# EAGLE design Robot Arm Controller (EAGLE 7.7.0)

## Sheet 1 of 2
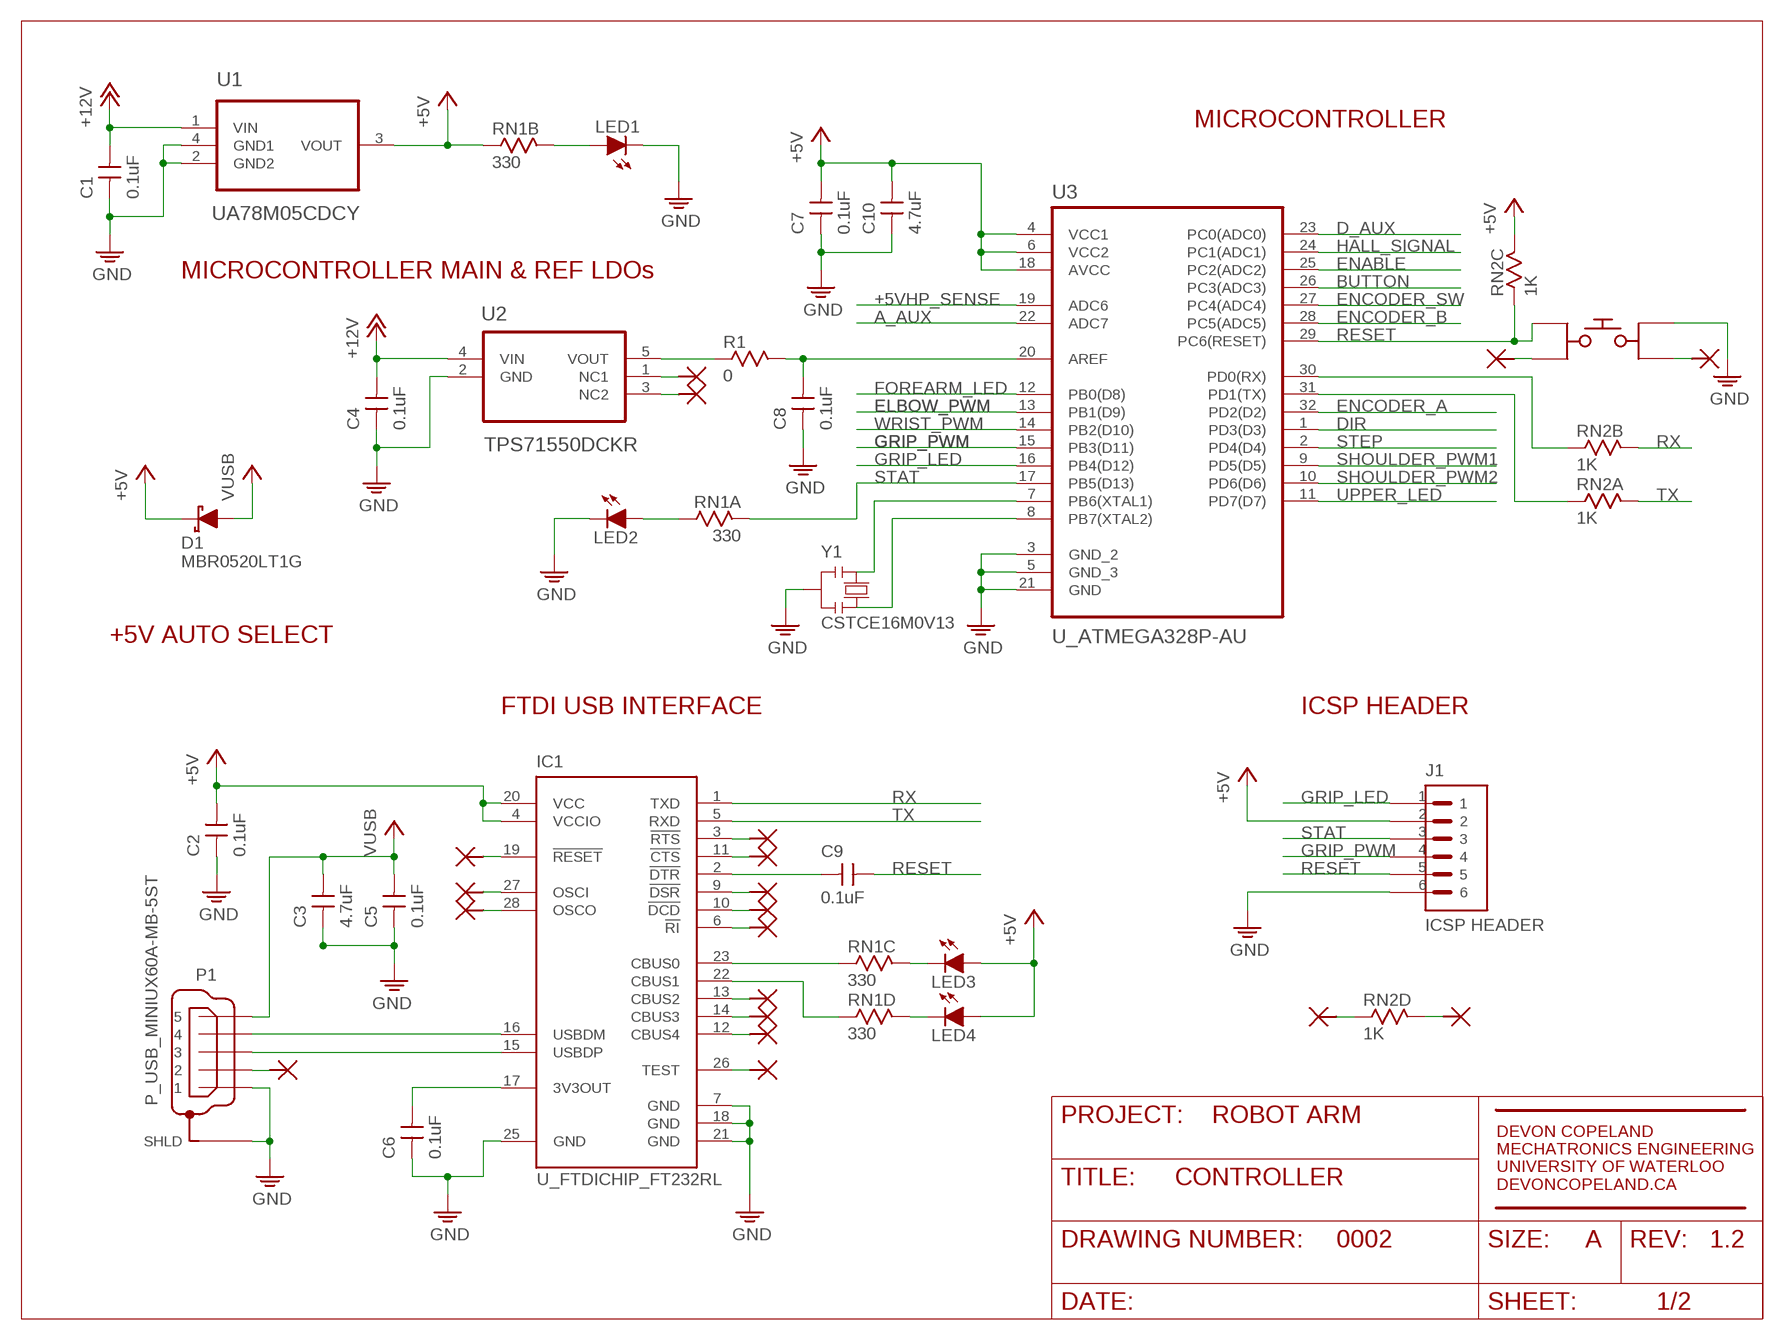
[diagram p0: schematic, sheet 1]

### Parts
C1  0.1uF  C_CAPACITORC0805  [C0805]
C2  0.1uF  C_CAPACITORC0805  [C0805]
C3  4.7uF  C_CAPACITORC0805  [C0805]
C4  0.1uF  C_CAPACITORC0805  [C0805]
C5  0.1uF  C_CAPACITORC0805  [C0805]
C6  0.1uF  C_CAPACITORC0805  [C0805]
C7  0.1uF  C_CAPACITORC0805  [C0805]
C8  0.1uF  C_CAPACITORC0805  [C0805]
C9  0.1uF  C_CAPACITORC0805  [C0805]
C10  4.7uF  C_CAPACITORC0805  [C0805]
D1  MBR0520LT1G  D_SCHOTTKY_MBR0520LT1G  [MBR0520LT1G]
IC1  U_FTDICHIP_FT232RL  [SSOP28]
J1  ICSP HEADER  J_HEADER_RECTANGULAR_2X6  [RECTANGULAR_HEADER_2X3]
LED1  D_LEDSML0805  [SML0805]
LED2  D_LEDSML0805  [SML0805]
LED3  D_LEDSML0805  [SML0805]
LED4  D_LEDSML0805  [SML0805]
P1  P_USB_MINIUX60A-MB-5ST  [UX60A-MB-5ST]
R1  0  R_RESISTOR0805  [R0805]
RN1  330  R_RESISTOR_NETWORK_EXB-V8V103JV  [EXBV8V]
RN2  1K  R_RESISTOR_NETWORK_EXB-V8V103JV  [EXBV8V]
S1  S_BUTTON_TACTILE_PTS645  [PTS645-SMD]
U1  UA78M05CDCY  U_5VLDO_UA78M05CDCY  [SOT230P700X180-4N]
U2  TPS71550DCKR  U_5VLDO_TPS71550DCKR  [SOT65P210X110-5N]
U3  U_ATMEGA328P-AU  [QFP80P900X900X120-32N]
Y1  CSTCE16M0V13  G_RESONATORMU  [CSTCE_V13L]

### Nets
+5V: C2.1 C7.1 C10.1 D1.C IC1.4(VCCIO) IC1.20(VCC) J1.2 LED3.A LED4.A RN1.2A RN2.3B U1.3(VOUT) U3.4(VCC1) U3.6(VCC2) U3.18(AVCC) ; also sheet 2
+5VHP_SENSE: U3.19(ADC6) ; also sheet 2
+12V: C1.1 C4.1 U1.1(VIN) U2.4(VIN) ; also sheet 2
A_AUX: U3.22(ADC7) ; also sheet 2
BUTTON: U3.26(PC3(ADC3)) ; also sheet 2
D_AUX: U3.23(PC0(ADC0)) ; also sheet 2
DIR: U3.1(PD3(D3)) ; also sheet 2
ELBOW_PWM: U3.13(PB1(D9)) ; also sheet 2
ENABLE: U3.25(PC2(ADC2)) ; also sheet 2
ENCODER_A: U3.32(PD2(D2)) ; also sheet 2
ENCODER_B: U3.28(PC5(ADC5)) ; also sheet 2
ENCODER_SW: U3.27(PC4(ADC4)) ; also sheet 2
FOREARM_LED: U3.12(PB0(D8)) ; also sheet 2
GND: C1.2 C2.2 C3.2 C4.2 C5.2 C6.2 C7.2 C8.2 C10.2 IC1.7(GND) IC1.18(GND) IC1.21(GND) IC1.25(GND) J1.6 LED1.C LED2.C P1.5 P1.M1(SHLD) P1.M2(SHLD) P1.M3(SHLD) P1.M4(SHLD) S1.1 U1.2(GND2) U1.4(GND1) U2.2(GND) U3.3(GND_2) U3.5(GND_3) U3.21(GND) Y1.2 ; also sheet 2
GRIP_LED: J1.1 U3.16(PB4(D12)) ; also sheet 2
GRIP_PWM: J1.4 U3.15(PB3(D11)) ; also sheet 2
HALL_SIGNAL: U3.24(PC1(ADC1)) ; also sheet 2
N$1: IC1.19(!RESET)
N$2: IC1.27(OSCI)
N$3: LED2.A RN1.1B
N$4: U3.8(PB7(XTAL2)) Y1.3
N$5: IC1.28(OSCO)
N$6: C8.1 R1.2 U3.20(AREF)
N$7: U2.1(NC1)
N$8: IC1.16(USBDM) P1.2
N$9: RN2.1A U3.31(PD1(TX))
N$10: U2.3(NC2)
N$11: C6.1 IC1.17(3V3OUT)
N$12: IC1.26(TEST)
N$13: IC1.12(CBUS4)
N$14: IC1.14(CBUS3)
N$15: IC1.13(CBUS2)
N$16: U3.7(PB6(XTAL1)) Y1.1
N$17: LED1.A RN1.2B
N$18: R1.1 U2.5(VOUT)
N$20: RN2.2A U3.30(PD0(RX))
N$21: IC1.6(!RI)
N$22: IC1.10(!DCD)
N$23: IC1.9(!DSR)
N$24: IC1.11(!CTS)
N$25: IC1.3(!RTS)
N$26: IC1.15(USBDP) P1.3
N$27: C9.2 IC1.2(!DTR)
N$28: IC1.23(CBUS0) RN1.3A
N$29: IC1.22(CBUS1) RN1.4A
N$30: LED3.C RN1.3B
N$31: LED4.C RN1.4B
N$32: RN2.4A
N$33: RN2.4B
N$37: S1.2
N$38: S1.4
N$66: P1.4
RESET: C9.1 J1.5 RN2.3A S1.3 U3.29(PC6(RESET))
RX: IC1.1(TXD) RN2.2B
SHOULDER_PWM1: U3.9(PD5(D5)) ; also sheet 2
SHOULDER_PWM2: U3.10(PD6(D6)) ; also sheet 2
STAT: J1.3 RN1.1A U3.17(PB5(D13))
STEP: U3.2(PD4(D4)) ; also sheet 2
TX: IC1.5(RXD) RN2.1B
UPPER_LED: U3.11(PD7(D7)) ; also sheet 2
VUSB: C3.1 C5.1 D1.A P1.1
WRIST_PWM: U3.14(PB2(D10)) ; also sheet 2

### Notes on the sheet
- MICROCONTROLLER
- MICROCONTROLLER MAIN & REF LDOs
- +5V AUTO SELECT
- FTDI USB INTERFACE | ICSP HEADER
- ROBOT ARM
- CONTROLLER
- 0002 | A | 1.2

## Sheet 2 of 2
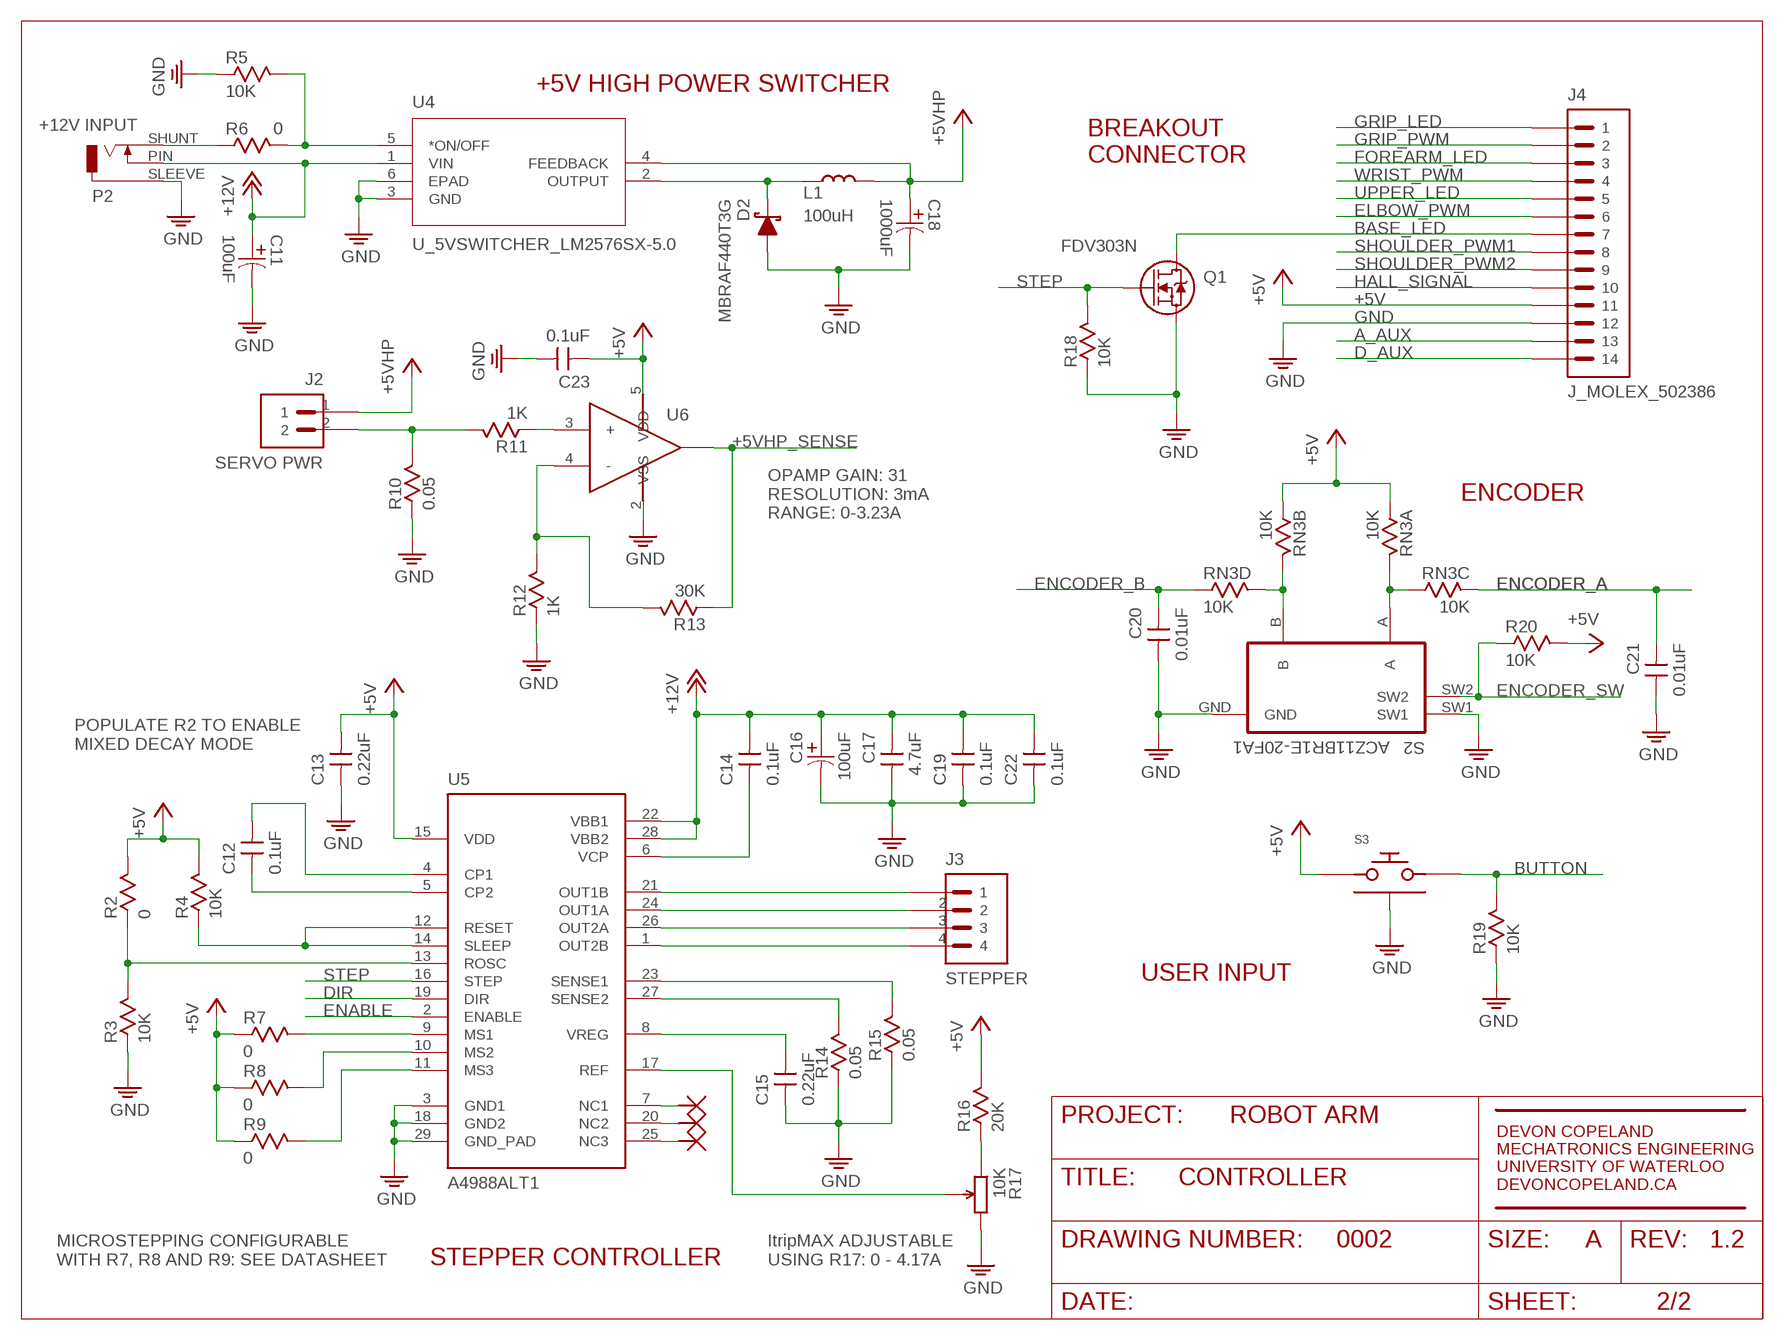
[diagram p1: schematic, sheet 2]

### Parts
C11  100uF  C_100UF_ALUMINUM_APXG160ARA101ME61G  [NPCAP_PXG_E61]
C12  0.1uF  C_CAPACITORC0805  [C0805]
C13  0.22uF  C_CAPACITORC0805  [C0805]
C14  0.1uF  C_CAPACITORC0805  [C0805]
C15  0.22uF  C_CAPACITORC0805  [C0805]
C16  100uF  C_100UF_ALUMINUM_APXG160ARA101ME61G  [NPCAP_PXG_E61]
C17  4.7uF  C_CAPACITORC0805  [C0805]
C18  1000uF  C_1000UF_ALUMINUM_APXG160ARA102MJA0G  [NPCAP_PXG_JA0]
C19  0.1uF  C_CAPACITORC0805  [C0805]
C20  0.01uF  C_CAPACITORC0805  [C0805]
C21  0.01uF  C_CAPACITORC0805  [C0805]
C22  0.1uF  C_CAPACITORC0805  [C0805]
C23  0.1uF  C_CAPACITORC0805  [C0805]
D2  MBRAF440T3G  D_SCHOTTKY_MBRAF440T3G  [MBRAF440T3G]
J2  SERVO PWR  J_SCREW_TERMINAL_2_POS  [SREW_TERMINAL_2_POS]
J3  STEPPER  J_SCREW_TERMINAL_4_POS  [SREW_TERMINAL_4_POS]
J4  J_MOLEX_502386  [MOLEX_502386]
L1  100uH  L_INDUCTOR_PA4344.104NLT  [PA4344.104NLT]
P2  +12V INPUT  P_BARREL_2.1MM  [RASM722PX]
Q1  FDV303N  Q_MOSFET_FDV303N  [SOT-23-3L]
R2  0  R_RESISTOR0805  [R0805]
R3  10K  R_RESISTOR0805  [R0805]
R4  10K  R_RESISTOR0805  [R0805]
R5  10K  R_RESISTOR0805  [R0805]
R6  0  R_RESISTOR0805  [R0805]
R7  0  R_RESISTOR0805  [R0805]
R8  0  R_RESISTOR0805  [R0805]
R9  0  R_RESISTOR0805  [R0805]
R10  0.05  R_RESISTOR1206  [R1206]
R11  1K  R_RESISTOR0805  [R0805]
R12  1K  R_RESISTOR0805  [R0805]
R13  30K  R_RESISTOR0805  [R0805]
R14  0.05  R_RESISTOR1206  [R1206]
R15  0.05  R_RESISTOR1206  [R1206]
R16  20K  R_RESISTOR0805  [R0805]
R17  10K  R_POT_EVM-2WSX80B14  [PANASONIC_P2W_POT]
R18  10K  R_RESISTOR0805  [R0805]
R19  10K  R_RESISTOR0805  [R0805]
R20  10K  R_RESISTOR0805  [R0805]
RN3  10K  R_RESISTOR_NETWORK_EXB-V8V103JV  [EXBV8V]
S2  ACZ11BR1E-20FA1  S_ENCODER_ACZ11BR1E-20FA1-20C  [ACZ11BR1E-20FA1-20C]
S3  S_BUTTON_TACTILE_KT11S1SA2M35LFG  [C&K_SA2M_SA1M]
U4  U_5VSWITCHER_LM2576SX-5.0  U_5VSWITCHER_LM2576SX-5.0/NOPB  [KTT5_6P22X6P86]
U5  A4988ALT1  U_STEPPER_DRIVER_A4988ALT1  [ALLEGRO_A4988]
U6  U_OPAMP_MCP6001T-E/OT  [SOT95P270X145-5N]

### Nets
+5V: C13.1 C23.2 J4.P11 R2.2 R4.2 R7.1 R8.1 R9.1 R16.2 R20.2 RN3.1A RN3.2A S3.1 U5.15(VDD) U6.5(VDD) ; also sheet 1
+5VHP: C18.+ J2.1 L1.2 U4.4(FEEDBACK)
+5VHP_SENSE: R13.1 U6.1(VOUT) ; also sheet 1
+12V: C11.+ C14.1 C16.+ C17.2 C19.1 C22.1 P2.PIN U4.1(VIN) U5.22(VBB1) U5.28(VBB2) ; also sheet 1
A_AUX: J4.P13 ; also sheet 1
BASE_LED: J4.P7 Q1.S(DRAIN)
BUTTON: R19.2 S3.2 ; also sheet 1
D_AUX: J4.P14 ; also sheet 1
DIR: U5.19(DIR) ; also sheet 1
ELBOW_PWM: J4.P6 ; also sheet 1
ENABLE: U5.2(ENABLE) ; also sheet 1
ENCODER_A: C21.2 RN3.3A ; also sheet 1
ENCODER_B: C20.2 RN3.4A ; also sheet 1
ENCODER_SW: R20.1 S2.SW2 ; also sheet 1
FOREARM_LED: J4.P3 ; also sheet 1
GND: C11.- C13.2 C15.2 C16.- C17.1 C18.- C19.2 C20.1 C21.1 C22.2 C23.1 D2.A J4.P12 P2.SLEEVE Q1.D(SOURCE) R3.1 R5.1 R10.1 R12.1 R14.1 R15.1 R17.3 R18.1 R19.1 S2.GND S2.SW1 S3.FRONT(HOUSING) S3.SIDE1(HOUSING) S3.SIDE2(HOUSING) U4.3(GND) U4.6(EPAD) U5.3(GND1) U5.18(GND2) U5.29(GND_PAD) U6.2(VSS) ; also sheet 1
GRIP_LED: J4.P1 ; also sheet 1
GRIP_PWM: J4.P2 ; also sheet 1
HALL_SIGNAL: J4.P10 ; also sheet 1
N$19: D2.C L1.1 U4.2(OUTPUT)
N$34: RN3.2B RN3.4B S2.B
N$35: R5.2 R6.2 U4.5(*ON/OFF)
N$36: RN3.1B RN3.3B S2.A
N$40: J3.1 U5.21(OUT1B)
N$43: R11.1 U6.3(+)
N$44: R12.2 R13.2 U6.4(-)
N$45: J2.2 R10.2 R11.2
N$46: J3.2 U5.24(OUT1A)
N$47: J3.3 U5.26(OUT2A)
N$48: J3.4 U5.1(OUT2B)
N$50: C15.1 U5.8(VREG)
N$51: R14.2 U5.27(SENSE2)
N$52: R16.1 R17.1
N$53: R15.2 U5.23(SENSE1)
N$54: R17.2 U5.17(REF)
N$55: U5.7(NC1)
N$56: U5.20(NC2)
N$57: U5.25(NC3)
N$58: C14.2 U5.6(VCP)
N$59: C12.2 U5.5(CP2)
N$60: C12.1 U5.4(CP1)
N$61: R8.2 U5.10(MS2)
N$62: R7.2 U5.9(MS1)
N$63: R9.2 U5.11(MS3)
N$64: R4.1 U5.12(RESET) U5.14(SLEEP)
N$65: R2.1 R3.2 U5.13(ROSC)
N$67: P2.SHUNT R6.1
SHOULDER_PWM1: J4.P8 ; also sheet 1
SHOULDER_PWM2: J4.P9 ; also sheet 1
STEP: Q1.G(GATE) R18.2 U5.16(STEP) ; also sheet 1
UPPER_LED: J4.P5 ; also sheet 1
WRIST_PWM: J4.P4 ; also sheet 1

### Notes on the sheet
- +5V HIGH POWER SWITCHER
- BREAKOUT
  CONNECTOR
- ENCODER
- OPAMP GAIN: 31
  RESOLUTION: 3mA 
  RANGE: 0-3.23A
- POPULATE R2 TO ENABLE
  MIXED DECAY MODE
- USER INPUT
- ROBOT ARM
- CONTROLLER
- 0002 | A | 1.2
- MICROSTEPPING CONFIGURABLE 
  WITH R7, R8 AND R9: SEE DATASHEET
- STEPPER CONTROLLER
- ItripMAX ADJUSTABLE
  USING R17: 0 - 4.17A

## Library data of the parts
C1-C10 C12-C15 C17 C19-C23 = devon:C_CAPACITOR: CAPACITOR, European symbol; SPICEMODEL: NONE; SPICEPREFIX: C
C11 C16 = devon:C_100UF_ALUMINUM_APXG160ARA101ME61G; DIGIKEY_PN: 565-4527-1-ND
C18 = devon:C_1000UF_ALUMINUM_APXG160ARA102MJA0G; DIGIKEY_PN: 565-4292-1-ND
D1 = devon:D_SCHOTTKY_MBR0520LT1G; DIGIKEY_PN: MBR0520LT1GOSCT-ND
D2 = devon:D_SCHOTTKY_MBRAF440T3G
IC1 = devon:U_FTDICHIP_FT232R: Source: http://www.ftdichip.com/Documents/DataSheets/DS_FT232R_v104.pdf; MPN: FT232RL; OC_FARNELL: 1146032; OC_NEWARK: 91K9918
J1 = devon:J_HEADER_RECTANGULAR_2X6
J2 = devon:J_SCREW_TERMINAL_2_POS
J3 = devon:J_SCREW_TERMINAL_4_POS
J4 = devon:J_MOLEX_502386
L1 = devon:L_INDUCTOR_PA4344.104NLT
LED1-LED4 = devon:D_LED: LED OSRAM: - CHIPLED LG R971, LG N971, LY N971, LG Q971, LY Q971, LO R971, LY R971 LH N974, LH R974 LS Q976, LO Q976, LY Q976 LO Q996 - Hyper CHIPLED LW Q18S LB Q993, LB Q99A, LB R99A - SideLED LS A670, LO A670, LY A670, LG A670, LP A670 LB A673, LV A673, LT A673, LW A673 LH A674 LY A675 LS A676, LA A676, LO A676, LY A676, LW A676 LS A679, LY A679, LG A679 - Hyper Micro SIDELED® LS Y876, LA Y876, LO Y876, LY Y876 LT Y87S - SmartLED LW L88C, LW L88S LB L89C, LB L89S, LG L890 LS L89K, LO L89K, LY L89K LS L896, LA L896, LO L896, LY L896 - TOPLED LS T670, LO T670, LY T670, LG T670, LP T670 LSG T670, LSP T670, LSY T670, LOP T670, LYG T670 LG T671, LOG T671, LSG T671 LB T673, LV T673, LT T673, LW T673 LH T674 LS T676, LA T676, LO T676, LY T676, LB T676, LH T676, LSB T676, LW T676 LB T67C, LV T67C, LT T67C, LS T67K, LO T67K, LY T67K, LW E67C LS E67B, LA E67B, LO E67B, LY E67B, LB E67C, LV E67C, LT E67C LW T67C LS T679, LY T679, LG T679 LS T770, LO T770, LY T770, LG T770, LP T770 LB T773, LV T773, LT T773, LW T773 LH T774 LS E675, LA E675, LY E675, LS T675 LS T776, LA T776, LO T776, LY T776, LB T776 LHGB T686 LT T68C, LB T68C - Hyper Mini TOPLED® LB M676 - Mini TOPLED Santana® LG M470 LS M47K, LO M47K, LY M47K Source: http://www.osram.convergy.de LUXEON: - LUMILED® LXK2-PW12-R00, LXK2-PW12-S00, LXK2-PW14-U00, LXK2-PW14-V00 LXK2-PM12-R00, LXK2-PM12-S00, LXK2-PM14-U00 LXK2-PE12-Q00, LXK2-PE12-R00, LXK2-PE12-S00, LXK2-PE14-T00, LXK2-PE14-U00 LXK2-PB12-K00, LXK2-PB12-L00, LXK2-PB12-M00, LXK2-PB14-N00, LXK2-PB14-P00, LXK2-PB14-Q00 LXK2-PR12-L00, LXK2-PR12-M00, LXK2-PR14-Q00, LXK2-PR14-R00 LXK2-PD12-Q00, LXK2-PD12-R00, LXK2-PD12-S00 LXK2-PH12-R00, LXK2-PH12-S00 LXK2-PL12-P00, LXK2-PL12-Q00, LXK2-PL12-R00 Source: www.luxeon.com KINGBRIGHT: KA-3528ASYC Source: www.kingbright.com
P1 = devon:P_USB_MINI: MINI USB Connector Source: http://www.hirose.co.jp/cataloge_hp/e24000019.pdf; OC_FARNELL: unknown; OC_NEWARK: unknown
P2 = devon:P_BARREL_2.1MM
Q1 = devon:Q_MOSFET_FDV303N; COPYRIGHT: Copyright C 2015 Accelerated Designs. All rights reserved; MANUFACTURER_PART_NUMBER: FDV303N; VENDOR: Fairchild Semiconductor
R1-R16 R18-R20 = devon:R_RESISTOR
R17 = devon:R_POT_EVM-2WSX80B14
RN1-RN3 = devon:R_RESISTOR_NETWORK_EXB-V8V103JV
S1 = devon:S_BUTTON_TACTILE_PTS645
S2 = devon:S_ENCODER_ACZ11BR1E-20FA1-20C
S3 = devon:S_BUTTON_TACTILE_KT11S1SA2M35LFG
U1 = devon:U_5VLDO_UA78M05CDCY: IC, LINEAR VOLT REGULATOR, 5V; MPN: UA78M05CDCY; OC_FARNELL: 1575761; OC_NEWARK: 77C1885; PACKAGE: SOT-223-3; SUPPLIER: TEXAS INSTRUMENTS
U2 = devon:U_5VLDO_TPS71550DCKR: Linear Regulator; MPN: TPS71550DCKR; OC_FARNELL: 1652373; OC_NEWARK: 34H2504; PACKAGE: SC-70-5; SUPPLIER: Texas Instruments
U3 = devon:U_ATMEGA328P-AU: 8-bit Microcontroller with In-System Programmable Flash; MPN: ATMEGA328P-AU; OC_FARNELL: 1715486; OC_NEWARK: 14R4631; PACKAGE: TQFP-32; SUPPLIER: Atmel
U4 = devon:U_5VSWITCHER_LM2576SX-5.0/NOPB; COPYRIGHT: Copyright C 2015 Accelerated Designs. All rights reserved; DATASHEETURL: httpwww.ti.comlitgpnTL257505; FAMILY_NAME: STEPDOWN REGULATOR; GENERIC_PART_NUMBER: TL257505; INDUSTRY_STD_PKG_TYPE: DDPAKTO263; MANUFACTURER: Texas Instruments; MANUFACTURER_PART_NUMBER: tl257505_ktt_5; PACKAGE_DESIGNATOR: KTT; PIN_COUNT: 5; VENDOR: Texas Instruments
U5 = devon:U_STEPPER_DRIVER_A4988: DMOS Microstepping Driver with Translator; PROD_ID: IC-11483
U6 = devon:U_OPAMP_MCP6001T-E/OT: 1 MHz, Low-Power Op Amp; MPN: MCP6001T-E/OT; OC_FARNELL: 1332116; OC_NEWARK: 34M7471; PACKAGE: SOT23-5; SUPPLIER: Microchip
Y1 = devon:G_RESONATOR

## Board
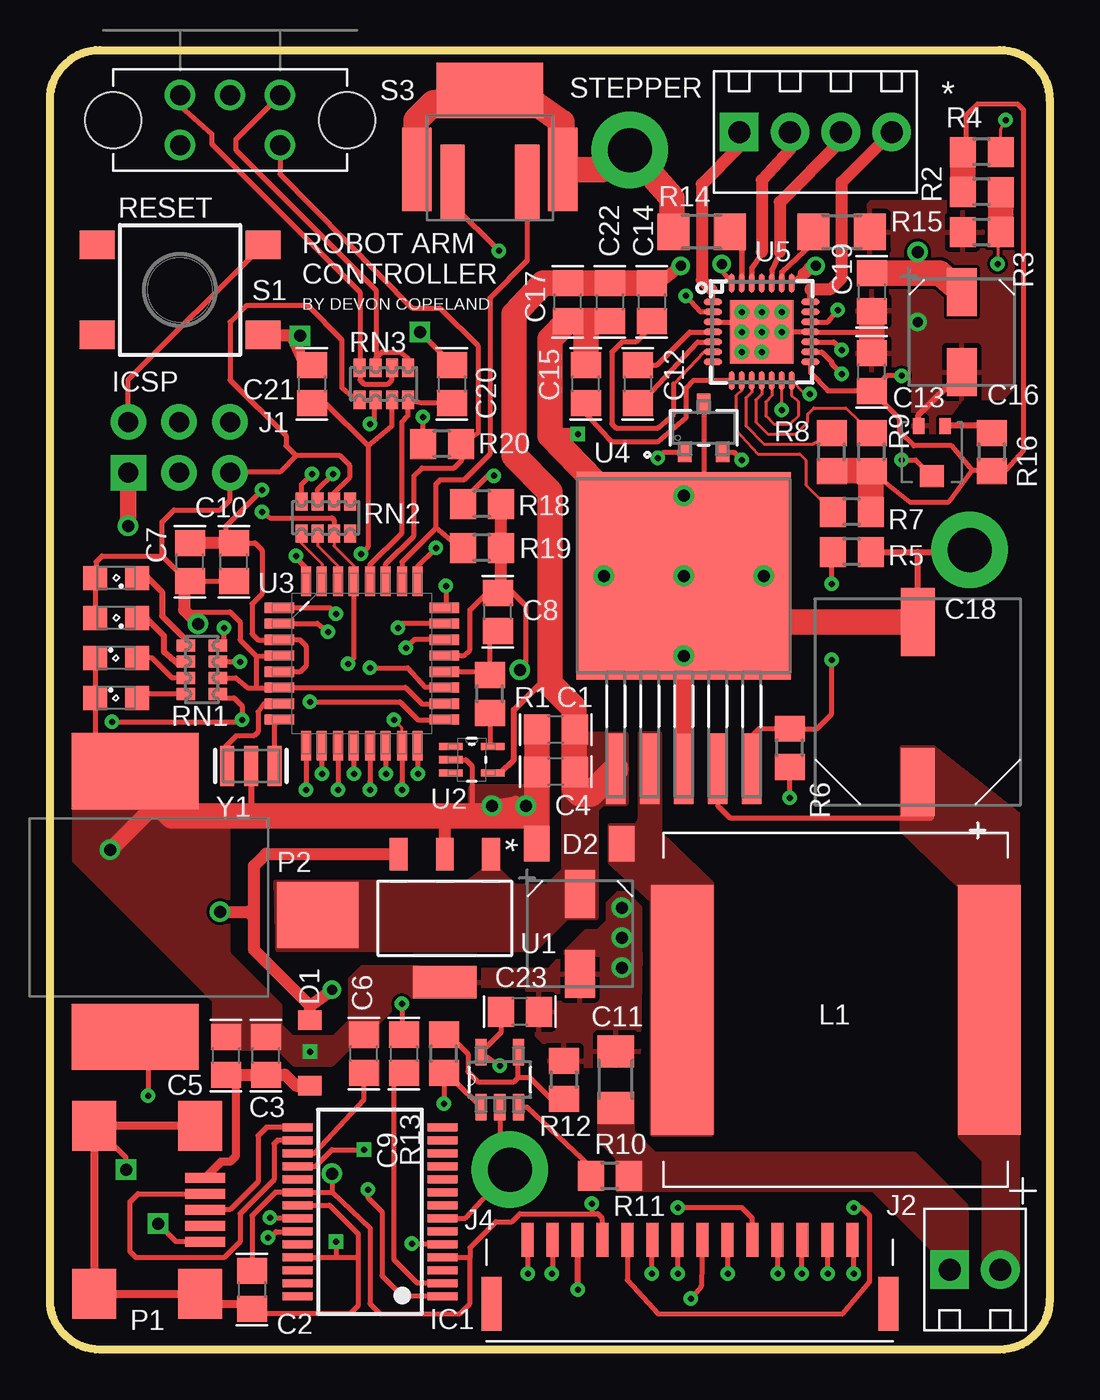
[diagram p2: board, top side]
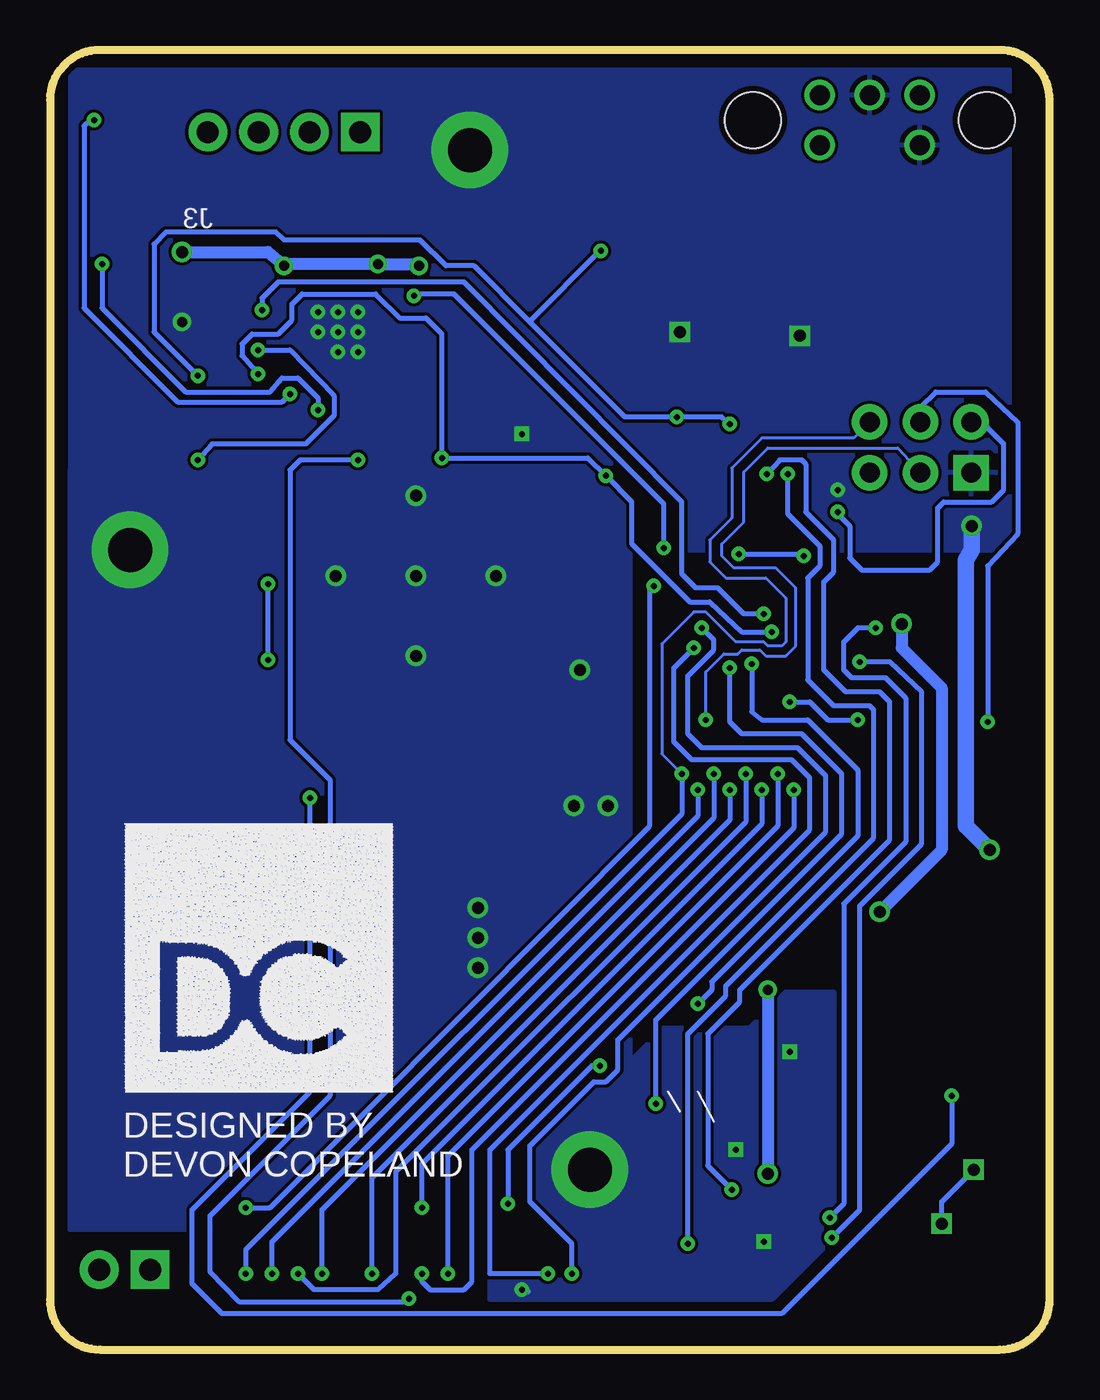
[diagram p3: board, bottom side, seen from below]

Size 50 x 65 mm. Coordinates in mm from the lower left corner, seen from the top.
Outline: 50,62.5 50,2.5 arc-90 47.5,0 2.5,0 arc-90 0,2.5 0,62.5 arc-90 2.5,65 47.5,65 arc-90 50,62.5
Copper layers (1*16): Top 0.035mm / dielectric 1.5mm / Bottom 0.035mm
Design rules "default *": minimum track width 0.16mm, minimum drill 0.3mm, track to track 0.16mm, track to pad 0.2mm, pad to pad 0.2mm, via to via 0.16mm, smd to smd 0.16mm, copper to edge 0.3mm, drill to drill 0.24mm, minimum pad ring 10mil, minimum via ring 8mil, stop-mask expansion 0mil, vias tented up to drill 0mil, thermal gap 10mil

### Footprints (pad centres in the part's own frame; a part is rotated, then mirrored left to right if it is on the bottom)
C0805 = smd 1.3 x 1.5: 1 -0.95,0; 2 0.95,0
NPCAP_PXG_E61 = smd 1.5 x 2.4: + 0,2; - 0,-2
NPCAP_PXG_JA0 = smd 1.7 x 3.4: + 0,4; - 0,-4
MBR0520LT1G = smd 0.965 x 1.168: A 3.277,0; C 0,0
MBRAF440T3G = smd 1.27 x 1.778: A 4.26,0; C 0,0
SSOP28 = smd 0.4 x 1.5: 1 -4.225,-3.625; 2 -3.575,-3.625; 3 -2.925,-3.625; 4 -2.275,-3.625; 5 -1.625,-3.625; 6 -0.975,-3.625; 7 -0.325,-3.625; 8 0.325,-3.625; 9 0.975,-3.625; 10 1.625,-3.625; 11 2.275,-3.625; 12 2.925,-3.625; 13 3.575,-3.625; 14 4.225,-3.625; 15 4.225,3.625; 16 3.575,3.625; 17 2.925,3.625; 18 2.275,3.625; 19 1.625,3.625; 20 0.975,3.625; 21 0.325,3.625; 22 -0.325,3.625; 23 -0.975,3.625; 24 -1.625,3.625; 25 -2.275,3.625; 26 -2.925,3.625; 27 -3.575,3.625; 28 -4.225,3.625
RECTANGULAR_HEADER_2X3 = drill 1 pad 1.778: 1 0,0; 2 2.54,0; 3 0,-2.54; 4 2.54,-2.54; 5 0,-5.08 | drill 1 pad 1.778 square: 6 2.54,-5.08
SREW_TERMINAL_2_POS = drill 1.1 pad 1.93: 1 2.54,0 | drill 1.1 pad 1.93 square: 2 0,0
SREW_TERMINAL_4_POS = drill 1.1 pad 1.93: 1 0,0; 2 2.54,0; 3 5.08,0 | drill 1.1 pad 1.93 square: 4 7.62,0
MOLEX_502386 = smd 1 x 2.7: NC1 -9.925,3.2; NC2 9.925,3.2 | smd 0.6 x 1.7: P1 -8.125,0; P2 -6.875,0; P3 -5.625,0; P4 -4.375,0; P5 -3.125,0; P6 -1.875,0; P7 -0.625,0; P8 0.625,0; P9 1.875,0; P10 3.125,0; P11 4.375,0; P12 5.625,0; P13 6.875,0; P14 8.125,0
PA4344.104NLT = smd 12.5 x 3.15: 1 0,7.675; 2 0,-7.675
SML0805 = smd 1.2 x 1.2: A 1.05,0; C -1.05,0
UX60A-MB-5ST = smd 2 x 0.5: 1 2.25,1.6; 2 2.25,0.8; 3 2.25,0; 4 2.25,-0.8; 5 2.25,-1.6 | smd 2.2 x 2.5: M1 -3.3,-4.2; M2 -3.3,4.2; M3 2,4.2; M4 2,-4.2
RASM722PX = smd 3.302 x 4.064: PIN 0.762,12.903 | smd 3.302 x 6.35: SHUNT 6.858,3.759 | smd 3.81 x 6.35: SLEEVE -6.426,3.759
SOT-23-3L = smd 0.66 x 0.914: D 0,1.245; G -0.95,-1.245; S 0.95,-1.245
R0805 = smd 1.3 x 1.5: 1 -0.95,0; 2 0.95,0
R1206 = smd 1.6 x 1.803: 1 -1.422,0; 2 1.422,0
PANASONIC_P2W_POT = smd 0.575 x 0.8: 1 -0.662,-1.3; 3 0.662,-1.3 | smd 1.2 x 1.1: 2 0,1.2
EXBV8V = smd 0.914 x 0.61: 1A -0.8,1.219; 1B 0.8,1.219; 2A -0.8,0.406; 2B 0.8,0.406; 3A -0.8,-0.406; 3B 0.8,-0.406; 4A -0.8,-1.219; 4B 0.8,-1.219
PTS645-SMD = smd 1.75 x 1.4: 1 -4.15,2.25; 2 4.15,2.25; 3 -4.15,-2.25; 4 4.15,-2.25
ACZ11BR1E-20FA1-20C = drill 1: A -2.5,1.25; B 2.5,1.25; GND 0,1.25; SW1 -2.5,-1.25; SW2 2.5,-1.25 | hole 2.8: -5.85,0; 5.85,0
C&K_SA2M_SA1M = smd 1.205 x 3.76: 1 -1.873,1.88; 2 1.873,1.88 | smd 5.33 x 2.79: FRONT 0,6.475 | smd 1.46 x 4.19: SIDE1 -3.65,2.525; SIDE2 3.65,2.525
SOT230P700X180-4N = smd 1.626 x 0.889: 1 -3.2,2.311; 2 -3.2,0; 3 -3.2,-2.311 | smd 1.626 x 3.175: 4 3.2,0
SOT65P210X110-5N = smd 1.168 x 0.356: 1 -1.041,0.66; 2 -1.041,0; 3 -1.041,-0.66; 4 1.041,-0.66; 5 1.041,0.66
QFP80P900X900X120-32N = smd 1.473 x 0.508: 1 -4.115,2.794; 2 -4.115,2.007; 3 -4.115,1.194; 4 -4.115,0.406; 5 -4.115,-0.406; 6 -4.115,-1.194; 7 -4.115,-2.007; 8 -4.115,-2.794; 17 4.115,-2.794; 18 4.115,-2.007; 19 4.115,-1.194; 20 4.115,-0.406; 21 4.115,0.406; 22 4.115,1.194; 23 4.115,2.007; 24 4.115,2.794 | smd 0.508 x 1.473: 9 -2.794,-4.115; 10 -2.007,-4.115; 11 -1.194,-4.115; 12 -0.406,-4.115; 13 0.406,-4.115; 14 1.194,-4.115; 15 2.007,-4.115; 16 2.794,-4.115; 25 2.794,4.115; 26 2.007,4.115; 27 1.194,4.115; 28 0.406,4.115; 29 -0.406,4.115; 30 -1.194,4.115; 31 -2.007,4.115; 32 -2.794,4.115
KTT5_6P22X6P86 = smd 0.965 x 3.505: 1 -3.4,-9.652; 2 -1.7,-9.652; 3 0,-9.652; 4 1.7,-9.652; 5 3.4,-9.652 | smd 10.719 x 10.363: 6 0,0
ALLEGRO_A4988 = smd 0.94 x 0.3: 1 -2.44,1.5; 2 -2.44,1; 3 -2.44,0.5; 4 -2.44,0; 5 -2.44,-0.5; 6 -2.44,-1; 7 -2.44,-1.5; 15 2.44,-1.5; 16 2.44,-1; 17 2.44,-0.5; 18 2.44,0; 19 2.44,0.5; 20 2.44,1; 21 2.44,1.5 | smd 0.3 x 0.94: 8 -1.5,-2.44; 9 -1,-2.44; 10 -0.5,-2.44; 11 0,-2.44; 12 0.5,-2.44; 13 1,-2.44; 14 1.5,-2.44; 22 1.5,2.44; 23 1,2.44; 24 0.5,2.44; 25 0,2.44; 26 -0.5,2.44; 27 -1,2.44; 28 -1.5,2.44 | smd 3.175 x 3.175: 29 0,0
SOT95P270X145-5N = smd 1.321 x 0.559: 1 -1.372,0.94; 2 -1.372,0; 3 -1.372,-0.94; 4 1.372,-0.94; 5 1.372,0.94
CSTCE_V13L = smd 0.7 x 2: 1 -1.199,0; 2 0,0; 3 1.199,0

### Placement (x,y rotation side)
C1  25.3,31.01 180 top
C2  10.1,3 270 top
C3  10.8,14.7 90 top
C4  25.3,28.9 180 top
C5  8.81,14.7 90 top
C6  15.7,14.8 90 top
C7  7,39.4 90 top
C8  22.4,36.9 90 top
C9  17.7,14.8 270 top
C10  9.2,39.4 90 top
C11  26.5,20.8 0 top
C12  29.4,48.3 270 top
C13  41.1,48.9 90 top
C14  30.1,52.4 270 top
C15  26.8,48.3 90 top
C16  45.6,50.9 0 top
C17  25.9,52.4 90 top
C18  43.4,32.4 180 top
C19  41.1,52.9 270 top
C20  20.1,48.3 270 top
C21  13.1,48.3 270 top
C22  28,52.4 270 top
C23  23.5,16.9 180 top
D1  13,16.48 270 top
D2  28.6,25.3 180 top
IC1  16,6.9 90 top
J1  9,46.4 270 top
J2  45,4 0 top
J3  42.1,60.9 180 top
J4  32,5.5 180 top
L1  39.3,17 90 top
LED1  3.3,34.6 0 top
LED2  3.3,32.6 0 top
LED3  3.3,36.6 180 top
LED4  3.3,38.6 180 top
P1  5.5,7 0 top
P2  0.5,22.5 270 top
Q1  32.7,46.1 0 top
R1  22,32.8 90 top
R2  46.6,57.9 180 top
R3  46.6,55.9 0 top
R4  46.6,59.9 180 top
R5  40.1,39.9 180 top
R6  37,30.1 90 top
R7  40.1,41.9 180 top
R8  39.1,44.9 90 top
R9  41.1,44.9 90 top
R10  28.3,13.5 270 top
R11  28,8.7 0 top
R12  25.7,13.5 270 top
R13  19.7,14.8 90 top
R14  32.6,55.9 0 top
R15  39.6,55.9 180 top
R16  47.1,44.9 270 top
R17  44.1,44.9 180 top
R18  21.6,42.3 180 top
R19  21.6,40.1 180 top
R20  19.6,45.3 180 top
RN1  7.6,34 180 top
RN2  13.8,41.61 90 top
RN3  16.7,48.3 90 top
S1  6.5,53 180 top
S2  9,61.5 0 top
S3  22,56.5 0 top
U1  19.75,21.57 270 top
U2  21.1,29.5 0 top
U3  15.6,34.31 0 top
U4  31.7,38.7 0 top
U5  35.6,50.9 0 top
U6  22.5,13.5 90 top
Y1  10.05,29.19 0 top

### Tracks (layer width: path | path; a pad name or v marks a point on that pad's centre or on a via)
+5V  (via drill 0.3, 0.5, 0.6)
  Top 0.16: R16.2 46.15,43.95
  Top 0.254: U5.15 38.04,48.86 38.9,47.95 C13.1 | R9.1 41.45,43.55 41.5,43.6 43,42.4 44.95,42.4 46.1,43.95 R16.2 | 46.15,43.95 45.1,45.2 43.2,45.2 42.5,45.9 42.5,46.55 C13.1 | 47.8,44 48.7,45 48.7,62 48.4,62.3 46.4,62.3 45.8,61.7 45.8,60.05 | C2.1 10.1,6.7 11.28,7.88 IC1.20 14.1,7.88 | 14.1,7.88 14.12,7.88 16,6.1 16,2.3 16.5,1.8 20.5,1.8 21,2.3 21,4.6 | 21,4.6 21,5.1 22.3,6.4 23.1,6.4 23.5,6.8 27.1,6.8 | 21,4.6 19.65,4.6 IC1.4 | 27.1,6.8 27.4,6.8 27.6,6.6 27.6,5.53 J4.P11 | C23.2 22.55,15.86 U6.5 | v22.5,14.2 21.63,14.8 | LED4.A LED3.A | 2.3,38.65 2.3,39.4 2.6,39.7 5.6,39.7 | RN1.2A 9.31,33.59 9.9,33.1 10.3,33.1 | 10.3,33.1 11.47,33.1 | 10.3,34.7 11.47,34.7 U3.4 | 10.3,34.7 10.3,33.1 | 10.3,34.7 9.5,35.5 9.5,36.4 9,36.9 7,36.9 6.9,36.8 | v14.1,8.8 14.1,7.88 | U3.6 17.78,33.12 18.6,32.3 U3.18 | v27.1,7.3 27.1,6.8 | 12.3,44.7 14.5,44.7 15,44.2 15,43.65 14.21,42.86 RN2.3B | 12.3,44.7 11.5,43.9 9.04,43.9 J1.2 | J1.2 9,43.8 | 7.15,38.3 C7.1 | C7.1 C10.1 | C7.1 6.65,38.45 6.65,38.65 5.6,39.7 | J1.2 9,42.5 8.5,42 6.2,42 5.6,41.4 5.6,39.7 | 12.3,44.7 11.8,45.2 11.8,45.7 9,48.5 9,51.4 9.8,52.2 12.9,52.2 14.6,50.5 14.6,48.1 15.3,47.5 RN3.1A RN3.2A 16.2,47.41 16.2,46.5 v16,46.3 | R20.2 v18.65,46.65 | v42.6,48.7 41.85,48.7 C13.1 | S3.1 20.13,57.27 v22.45,54.95
  Top 0.305: 47.8,44 47.15,44 R16.2 | 45.8,60.05 R4.2 | 21.63,14.8 U6.5 | 2.3,38.65 LED4.A | 11.47,33.1 U3.6
  Top 0.61: 13,17.2 10.2,20 10.2,21.6 | 10.2,21.6 10.2,24.2 10.8,24.8 17.41,24.8 U1.3 | D1.C 13,17.2 | 13,17.2 v14.1,18 | 7.15,38.3 6.7,38.3 6.7,37 6.9,36.8 v7.4,36.3 | v8.5,21.9 9.9,21.9 10.2,21.6
  Top 1.27: R4.2 R2.2 | R7.1 41.05,43.9 R9.1 R8.1
  Bottom 0.254: v22.5,14.2 22.9,14.2 27.1,10 v27.1,7.3 | 26.02,51.42 21.25,46.65 v18.65,46.65 16.4,46.65 v16,46.3 | 26.02,51.42 28.8,54.2 30.2,54.2 31.5,55.5 38.3,55.5 38.7,55.9 44.2,55.9 44.8,55.3 44.8,50.9 v42.6,48.7 | v22.45,54.95 22.5,54.95 26.02,51.42
  Bottom 0.61: v14.1,18 v14.1,8.8 | v7.4,36.3 7.4,35.1 5.4,33.1 5.4,25 v8.5,21.9
+5VHP
  Top 0.254: U4.4 33.4,27.2 34,26.6 44.1,26.6 44.1,28.7 C18.+
  pour Top (no thermals): 42.6,30.1 42.6,26 45.5,23.2 45.5,10.7 46.7,9.5 46.7,3.9 48.4,3.9 48.4,26.8 44.2,30.1
+5VHP_SENSE  (via drill 0.3)
  Top 0.254: U6.1 20.29,13.4 19.2,13.4 R13.1 v19.7,12.3 | U3.19 18.78,33.12 17.9,34.1 v16,34.1
  Bottom 0.254: v19.7,12.3 19.7,16.5 10.4,25.8 10.4,28.8 12.4,30.8 15.4,30.8 16,31.4 v16,34.1
+12V  (via drill 0.5, 0.6)
  Top 0.254: 37.7,53.8 37.66,53.8 U5.22 | v33.6,54.3 33.6,53.94 U5.28 | 26.2,32.1 26.2,31.06 C1.1
  Top 0.305: U2.4 22.54,28.84 23.2,29.5 23.2,32 24.5,33.3 25,33.3
  Top 0.61: C19.1 43.35,53.95 v43.4,54.9 | v38.3,54.2 38,54.1 37.7,53.8 | C14.1 30.45,53.35 v31.55,54.2
  Top 1.27: C19.1 44.5,53.85 C16.+ | C14.1 C22.1 C17.2 24.65,53.35 23.2,51.8 23.2,44.7 25,42.9 25,33.3 26.2,32.1 26.2,28.1 26.5,27.8 27.05,27.8 U4.1
  Bottom 0.61: v43.4,54.9 39.1,54.9 v38.3,54.2 38.15,54.3 v33.6,54.3 31.7,54.3 v31.55,54.2
  pour Top (no thermals): 11.3,23.4 20.9,23.4 21.7,24 21.7,25.5 22.4,25.5 22.4,24 23.2,23.2 24.9,23.2 25.7,24 25.7,28.7 26.6,30.8 28.8,30.8 28.8,27.3 27.6,27.3 27.3,27 27.3,21.6 25.8,21.6 24.2,20 11.4,20
A_AUX  (via drill 0.3)
  Top 0.254: U3.22 18.2,35.5 v17.8,35.1 | J4.P13 25.12,3.83 v25.1,3.8
  Bottom 0.254: v25.1,3.8 28,3.8 28,10 12,26 12,28.6 12.9,29.5 17.9,29.5 18.8,30.4 18.8,34.1 v17.8,35.1
BASE_LED  (via drill 0.3)
  Top 0.254: J4.P7 32.58,3.17 v32.05,2.55 | v34.6,44.5 34.24,44.85 Q1.S
  Bottom 0.254: v34.6,44.5 37.5,44.5 38,44 38,30.5 36,28.5 36,12.7 42,6.7 42,3.9 40.55,2.4 32.2,2.4 v32.05,2.55
BUTTON
  Top 0.254: U3.26 17.6,39.4 19.3,41.1 | S3.2 23.87,54.47 22,52.6 22,44.8 20.7,43.5 19.5,43.5 19.3,43.3 19.3,41.1 | R19.2 20.5,40.1 19.3,41.1
D_AUX  (via drill 0.3)
  Top 0.254: U3.23 17.62,36.32 v17.4,36.1 | J4.P14 23.88,3.83 v23.9,3.8
  Bottom 0.254: v23.9,3.8 23.9,5.3 26,7.4 26,10.2 22.8,13.4 22.2,13.4 21.6,14 21.6,15.5 11.2,25.9 11.2,28.7 12.6,30.1 17.4,30.1 18.1,30.8 18.1,33.7 16.8,35 16.8,35.5 v17.4,36.1
DIR  (via drill 0.3)
  Top 0.254: U5.19 38.9,51.4 v39.4,52 | U3.1 14,37.1 v14.3,36.8
  Bottom 0.254: v39.4,52 39.4,52.6 38.6,53.4 29.3,53.4 18.4,42.4 18.4,38.8 17.7,38.1 16.6,38.1 15.3,36.8 v14.3,36.8
ELBOW_PWM  (via drill 0.3)
  Top 0.254: U3.13 16.01,28.39 v16,28 | v33.9,3.8 33.9,5.53 J4.P6
  Bottom 0.254: v16,28 16,26.5 33.9,8.6 v33.9,3.8
ENABLE  (via drill 0.3)
  Top 0.254: U5.2 32.55,51.9 v31.8,52.7 | U3.25 18.39,39.19 v19.3,40.1
  Bottom 0.254: v31.8,52.7 31.7,52.8 29.8,52.8 19.3,42.3 v19.3,40.1
ENCODER_A  (via drill 0.3)
  Top 0.254: C21.2 13.75,47.35 15.9,45.2 | 15.9,45.2 17.1,46.2 17.1,47.39 RN3.3A | 15.9,45.2 15.9,40.15 v15.55,39.8 | v12.3,39.7 12.4,39.5 12.8,39.1 U3.32
  Bottom 0.254: v15.55,39.8 12.4,39.8 v12.3,39.7
ENCODER_B
  Top 0.254: U3.28 16.01,39.26 17.6,40.85 17.6,46.4 17.9,46.7 17.9,47.38 RN3.4A 18.57,47.35 C20.2
ENCODER_SW
  Top 0.254: U3.27 16.79,39.29 18.2,40.7 18.2,43.7 18.6,44.1 20.2,44.1 20.6,44.5 20.5,44.75 R20.1 21.4,45.85 21.4,50.2 19.5,52.1 18.1,52.1 11.5,58.8 S2.SW2
FOREARM_LED  (via drill 0.3)
  Top 0.254: U3.12 15.19,29.11 v15.2,28.8 | v37.6,3.8 37.6,5.47 J4.P3
  Bottom 0.254: v15.2,28.8 15.2,26.4 32.7,8.9 32.7,3.8 33.6,3 36.8,3 v37.6,3.8
GND  (via drill 0.3, 0.5, 0.6, 2.2 pad 3.81)
  Top 0.254: C19.2 40.55,50.9 U5.18 U5.29 | C17.1 25.75,51.45 | U6.2 22.5,9.9 v23,9 20.77,6.58 IC1.7 | IC1.21 13.97,7.22 15.4,5.8 15.4,4.7 | 15.4,4.7 15.4,2.2 15,1.8 10.55,1.8 C2.2 | IC1.25 14.3,4.62 | 14.3,4.62 15.32,4.62 15.4,4.7 | Q1.D 32.7,42.81 30.22,40.33 | LED1.C LED2.C 2.25,29.35 | v14.3,5.4 14.3,4.62 | C20.1 20.1,49.3 v18.5,50.9 | v23.5,34 23.8,34.3 23.8,37.2 23,38 22.55,38 | U3.5 12.5,33.9 12.8,34.2 12.8,35.2 12.5,35.5 U3.3 10.4,35.5 10.1,35.8 10.1,37.3 10.6,37.8 10.6,40 10.25,40.35 C10.2 | U3.21 20.72,34.72 21,35 21,37 22,38 22.55,38 | U5.3 34.6,51.4 | C7.2 8.65,40.35 8.8,40.5 8.8,41.2 v10.6,43 | U2.2 20.8,29.5 21.1,29.2 21.1,27 21.4,26.7 | IC1.18 13.28,9.18 14.1,10 v15.7,10 | 22.55,38 C8.2 | P1.5 6.3,5.4 v5.4,6.3 | v3.8,9 3.8,9.6 P1.M2
  Top 0.305: R17.3 43.44,46.74 C16.- | 2.25,29.35 2.3,29.3 3.88,29.3 P2.SLEEVE | Y1.2 10.05,26.75 10,26.7 | R5.1 43.4,39.9 | 43.4,39.9 45.1,39.9 v46,40 | C18.- 43.4,39.9 | J4.P12 26.38,3.02 v26.4,3 | 34.6,51.4 35,51 35.5,51 U5.29
  Top 0.406: C2.2 10.05,2.3 7.9,2.3 7.5,2.7 P1.M4 P1.M1 P1.M2 P1.M3
  Top 0.61: U1.2 19.75,26.35 20.1,26.7 | C10.2 C7.2 | C21.1 12.75,49.25 12.1,50.7 | 12.1,50.7 10.8,50.7 S1.1 | 12.1,50.7 v12.5,50.7 | 22.55,38 R19.1 R18.1 | v22.1,27.2 23.3,27.4 24,26.7 | v26.4,45.8 25.2,45.8 25,46
  Top 0.813: J1.6 3.92,41.22 v3.9,41.2 | v3,25 5.4,27.4
  Top 1: U4.3 v31.7,34.7 U4.6
  Top 1.27: C19.2 C13.2 | 26.8,51.45 C17.1 25,50.55 25,46 25,45.7 30.22,40.33 31.7,38.8 U4.6 32.8,36.4 C18.- | 26.8,51.45 C22.2 | C15.2 26.8,51.45 | 5.4,27.4 6.1,26.7 10,26.7 20.1,26.7 21.4,26.7 24,26.7 24.3,26.7 24.34,25.66 D2.A C4.2 C1.2 | S3.SIDE1 18.3,58.58 18.3,61.5 19.18,62.38 S3.FRONT 24.23,62.38 25.6,61.4 25.6,58.38 S3.SIDE2 27.62,59.02 v29,60 31.1,57.6 31.1,55.98 R14.1
  Bottom 0.254: v5.4,6.3 5.4,7.4 v3.8,9
  Bottom 0.305: v26.4,3 26.1,2.9
  Bottom 0.813: v3.9,41.2 3.9,40 4.2,39.5 4.2,26.2 v3,25
  other vias: 43.4,51.4 13,14.9 31.7,38.7 31.7,42.7 35.7,38.7 27.7,38.7 35.6,50.9 35.6,51.9 35.6,49.9 34.6,49.9 34.6,50.9 34.6,51.9 36.6,51.9 36.6,50.9 28.6,22.1 28.6,20.6 28.6,19.1 23.8,27.2
  pour Top: 41.1,57.4 48.1,57.4 48.1,48.1 47.6,47.6 45.6,47.6 44.3,45.9 43.2,45.9 43.2,48.6 42.8,49 41,49 40.4,49.6 40.4,56.7
  pour Top: 29.4,14.2 26.7,14.2 26.4,13.9 25,13.9 25,15.1 23.9,16.2 23.9,18.2 21.2,18.2 21.2,17.7 18.3,17.7 18.3,19 25,19 25.8,19.9 29.5,19.9
  pour Top (no thermals): 18.4,19.1 15.6,19.1 15,18.5 15,16.3 14.9,16.3 14.2,15.6 12.1,15.6 11.5,16.2 11.5,17.2 8.9,19.8 8.9,26.1 7.3,27.1 1.2,27.1 1.2,24.5 8.2,17.5 8.2,15.1 11.4,15.1 12.2,14.3 14.1,14.3 15,15.2 16.3,15.2 16.3,16.3 17.7,17.7 18.4,17.7
  pour Bottom: 10.8,17.9 10.8,5.6 13.9,2.5 28,2.5 28,5.7 25.6,7.7 25.5,9.9 19.3,16.1 15,16.1 13.2,17.9
  pour Bottom: 49,40 2,40 2,64 49,64
  pour Bottom: 21,44 21,6 49,6 49,44
  pour Top (no thermals): 24,26.8 21.2,26.8 21.2,28 24,28
  pour Top (no thermals): 29.5,19.9 29.5,22.1 28.8,22.8 28.4,22.8 27.9,22.3 27.9,21.4 27.4,20.9 26.8,20.9 25.8,19.9 25.8,19.8 29.4,19.8
GRIP_LED  (via drill 0.3)
  Top 0.254: U3.16 18.39,29.11 v18.4,28.8 | v40.2,3.8 40.2,5.42 J4.P1
  Bottom 0.16: J1.1 9.8,45.6 14.4,45.6 15.9,44.1 15.9,41.6 17,40.5 17,39.4 16.2,38.6 14.2,38.6 13.2,37.6 13.2,35.4 13.4,35.2 14.1,35.2 14.3,35.4 15.7,35.4 17.2,36.9 17.8,36.9 19.4,35.3 19.4,29.8 v18.4,28.8
  Bottom 0.254: v18.4,28.8 18.4,26.8 40.2,5 v40.2,3.8
GRIP_PWM  (via drill 0.3)
  Top 0.16: U3.15 17.61,31.09 v17.2,31.5
  Top 0.254: U3.15 17.61,28.39 v17.6,28 | v38.9,3.8 38.9,5.47 J4.P2
  Bottom 0.16: v17.2,31.5 17.2,33.9 16.3,34.8 15.6,34.8 15.4,35 14.5,35 14.2,34.7 13.2,34.7 12.7,35.2 12.7,38.1 13.7,39.1 15.8,39.1 16.4,39.7 16.4,40.3 15.3,41.4 15.3,43.9 14.1,45.1 7.6,45.1 J1.4
  Bottom 0.254: v17.6,28 17.6,26.7 38.9,5.4 v38.9,3.8
HALL_SIGNAL  (via drill 0.3)
  Top 0.254: J4.P10 28.88,3.48 30.4,1.8 39.65,1.8 41,3.4 41,6.7 40.6,7.1 v40.2,7.1 | v19.8,38.2 19.8,37.19 U3.24
  Bottom 0.254: v40.2,7.1 39,7.1 20,26.2 20,38 v19.8,38.2
N$3
  Top 0.254: RN1.1B 4.53,32.78
  Top 0.305: 4.53,32.78 LED2.A
N$4
  Top 0.254: Y1.3 11.25,31.28
  Top 0.305: 11.25,31.28 U3.8
N$6
  Top 0.254: U3.20 21.85,33.9 R1.2 22,35.55 C8.1
N$8
  Top 0.254: IC1.16 11.38,10.47 11.2,10.3 11.2,8.5 9.5,6.8 9.5,5.4 8.7,4.6 4.3,4.6 4,4.9 4,7.4 4.4,7.8 P1.2
N$9
  Top 0.16: RN2.1A 12.58,40.32 13.6,39.3 U3.31
N$11
  Top 0.254: IC1.17 13.22,9.82 15.7,12.5 C6.1
N$16
  Top 0.254: U3.7 10.7,32.3 10.4,31.9 10.4,30.9 10.2,30.7 9.3,30.7 8.8,30.2 8.8,29.24 Y1.1
N$17
  Top 0.254: RN1.2B 6.11,33.59 5.1,34.6 LED1.A
N$18
  Top 0.254: R1.1 22,30.3 U2.5
N$19
  pour Top (no thermals): 29.5,30.8 29.5,26.5 29.3,26.2 28,26.2 28,24.4 30.1,22.5 30.1,10.8 33.1,10.8 33.1,23.3 30.5,25.8 30.5,30.8
N$20
  Top 0.16: RN2.2A 13.39,40.21 14.4,39.2 U3.30
N$26
  Top 0.254: IC1.15 10.82,11.12 10.4,10.7 10.4,8.4 9,7 P1.3
N$27
  Top 0.254: IC1.2 18.38,3.33 17.2,4.5 17.2,13.7 17.35,13.85 C9.2
N$28  (via drill 0.3)
  Top 0.254: RN1.3A 9.19,34.41 v9.5,34.4 | v10.9,5.6 11,5.6 11.3,5.9 12.35,5.9 IC1.23
  Bottom 0.254: v10.9,5.6 9.5,7 9.5,22.2 6.4,25.3 6.4,32.9 8,34.4 v9.5,34.4
N$29  (via drill 0.3)
  Top 0.254: RN1.4A 8.7,35.4 v8.7,36.1 | v11,6.6 12.4,6.6 IC1.22
  Bottom 0.254: v8.7,36.1 9.6,36.1 10.3,35.4 10.3,34 9.9,33.6 8.2,33.6 7.2,32.6 7.2,25.4 10.3,22.3 10.3,7.3 v11,6.6
N$30
  Top 0.305: RN1.3B 6.39,34.31 5.7,34.9 5.7,35.7 4.9,36.5 4.45,36.5 LED3.C
N$31
  Top 0.305: LED4.C 4.9,38.6 5.6,37.9 5.6,36.7 6.3,36 6.82,35.5 RN1.4B
N$34
  Top 0.254: 16.3,49.6 16.3,53 9.3,60 9.3,60.55 S2.B | RN3.2B 16.3,49.6 | 16.3,49.6 16.6,49.9 17.5,49.9 17.9,49.6 17.9,49.12 RN3.4B
N$35  (via drill 0.3)
  Top 0.254: U4.5 35.1,30.7 35.45,31.05 R6.2 38.35,31.05 39.1,31.8 v39.1,34.5 | U4.5 | v39.1,38.3 39.1,39.85 R5.2
  Bottom 0.254: v39.1,34.5 v39.1,38.3
N$36
  Top 0.254: S2.A 6.5,62.2 8.1,60.8 8.1,60.3 15.5,52.9 15.5,49.12 | 15.5,49.12 RN3.1B | 15.5,49.12 15.5,48.5 15.7,48.3 16.9,48.3 17.1,48.5 RN3.3B
N$40
  Top 0.305: U5.21 38.04,52.99 38.05,53
  Top 0.61: 38.05,53 38.05,53.05 39.05,53.05 39.6,53.6 39.6,58.4 J3.1
N$43
  Top 0.254: U6.3 23.87,12.13 27,9.2 27,8.75 R11.1
N$44
  Top 0.254: R13.2 19.95,15.75 20.9,14.8 20.9,13.9 21.4,13.4 23.2,13.4 23.4,13.6 | 23.4,13.6 23.4,14.83 U6.4 | 23.4,13.6 24,13.6 25,12.6 25.65,12.6 R12.2
N$45
  pour Top (no thermals): 45.8,3.2 44.2,3.2 44.2,5 41.2,8 28.4,8 28.4,9.6 27.5,10.5 27.5,12.8 29.1,12.8 29.1,10.9 30.2,9.8 43.2,9.8 45.8,7.2
N$46
  Top 0.254: 36.5,54.9 36.5,54.85 36.1,54 U5.24
  Top 0.61: J3.2 39.56,60.46 36.5,57.4 36.5,54.9
N$47
  Top 0.28: 35.55,54.75 35.1,54.1 U5.26
  Top 0.305: 35.6,54.9 35.55,54.75
  Top 0.61: J3.3 37.02,60.02 35.6,58.5 35.6,54.9
N$48
  Top 0.305: 33.1,53 33.1,52.46 U5.1
  Top 0.61: J3.4 34.48,60.18 32.6,58.3 32.6,53.5 33.1,53
N$50
  Top 0.254: C15.1 26.8,46.8 27.9,45.6 28.1,45.4 30.4,45.4 31.8,46.6 31.8,48.1 32.16,48.46 U5.8
N$51
  Top 0.28: U5.27 34.6,55.8
  Top 0.305: 34.6,55.8 34.12,55.8 R14.2
N$52
  Top 0.305: R16.1 47.1,46.1 47,46.2 R17.1
N$53
  Top 0.28: U5.23 36.6,53.9 38.1,55.3
  Top 0.305: 38.1,55.3 38.1,55.82 R15.2
N$54  (via drill 0.3, 0.3 pad 0.25)
  Top 0.254: U5.17 39.2,50.4 v39.6,50 | v42.6,44.5 43.3,44.5 R17.2
  Bottom 0.254: v39.6,50 38,50 35.8,47.7 35.8,46.7 37.2,45.3 41.9,45.3 v42.6,44.5
N$58
  Top 0.18: 31.2,48.3 32.7,49.9 U5.6
  Top 0.254: 31.2,48.3 31.2,46.8 30.4,46.1 28.3,46.1 28.1,46.3 28.1,49.9 28.6,50.4 29.3,50.4 30.1,51.2 C14.2
N$59
  Top 0.254: C12.2 29.45,47.2 32.4,50.4 U5.5
N$60
  Top 0.254: C12.1 30.35,49.25 32,50.9 U5.4
N$61
  Top 0.16: U5.10 35.1,47.9 34.8,47.6 34.8,46.2 35.7,45.3 38.15,45.3 R8.2
N$62
  Top 0.16: U5.9 34.6,48 34.3,47.7 34.3,46 35.4,44.8 37.5,44.8 37.8,44.5 37.8,43.25 R7.2
N$63
  Top 0.16: U5.11 35.6,47.8 35.3,47.5 35.3,46.4 35.9,45.8 37.3,45.8 37.9,46.4 37.9,46.8 38.2,47.1 39.8,47.1 R9.2
N$64  (via drill 0.3)
  Top 0.16: U5.12 36.1,47.7 35.8,47.4 35.8,46.7 36.2,46.3 37,46.3 37.45,46.7 37.45,47.4 37.1,47.7 U5.14 37.76,47.8 v38,47.8 | R4.1 47.55,61.05 v47.8,61.5
  Bottom 0.254: v47.8,61.5 48.2,61.3 48.3,61.2 48.3,52.1 43.6,47.4 38.4,47.4 v38,47.8
N$65  (via drill 0.3)
  Top 0.16: R3.2 47.4,55.7 v47.4,54.3 | v36.6,47 U5.13
  Top 1.27: R2.1 R3.2
  Bottom 0.254: v47.4,54.3 47.4,52.1 43.2,47.9 39,47.9 38.4,48.6 37.6,48.6 36.6,47.6 v36.6,47
N$67  (via drill 0.3)
  Top 0.254: P2.SHUNT 4.9,15 v4.9,12.7 | v37,27.6 R6.1
  Bottom 0.254: v4.9,12.7 4.9,10.3 13.4,1.8 41.4,1.8 42.9,3.3 42.9,7 37,12.9 v37,27.6
RESET  (via drill 0.3)
  Top 0.16: RN2.3A 14.21,40.19 15.2,39.2 U3.29
  Top 0.254: v17.6,17.3 17.6,15.85 C9.1 | v10.6,41.9 11,41.6 14.1,41.6 14.2,41.5 RN2.3A | U3.29 15.19,34.59 v14.9,34.3 | J1.5 3.92,48.52 S1.3
  Bottom 0.254: v14.9,34.3 14.9,31.9 14.4,31.5 12.1,31.5 9.6,29 9.6,25.7 16.9,18.4 16.9,18 v17.6,17.3 | J1.5 3.4,46.4 2.3,45.3 2.3,43 2.9,42.4 5.3,42.4 5.6,42.1 5.6,39.4 6,39 9.4,39 10,39.6 10,41.2 10.6,41.8 v10.6,41.9
RX  (via drill 0.3)
  Top 0.254: v15.9,8 15.9,7.6 16.6,6.9 16.6,3.7 17.6,2.7 19.6,2.7 IC1.1 | RN2.2B 13.39,43.04 v14.15,43.8
  Bottom 0.254: v14.15,43.8 13.5,44.5 12.4,44.5 12.2,44.3 12.2,41.9 10.8,40.5 10.8,38.9 11.3,38.4 11.3,34 10.2,32.9 8.5,32.9 8,32.4 8,25.5 15.5,18 15.5,17.4 17.1,15.8 17.1,9.2 v15.9,8
SHOULDER_PWM1  (via drill 0.3)
  Top 0.254: U3.9 12.81,28.11 v12.8,28 | v31.4,3.8 31.4,5.42 J4.P8
  Bottom 0.254: v12.8,28 12.8,26.1 28.9,10 28.9,3.4 29.3,3 31,3 31.4,3.4 v31.4,3.8
SHOULDER_PWM2  (via drill 0.3)
  Top 0.254: v30.1,3.8 30.1,5.47 J4.P9 | U3.10 v13.59,28.81 v13.6,28.8
  Bottom 0.254: v13.6,28.8 13.6,26.2 30.1,9.7 v30.1,3.8
STAT  (via drill 0.3)
  Top 0.254: RN1.1A 8.58,32.6 9.2,32.6 9.6,32.2 v9.6,31.5 9.5,31.4 v3.1,31.4 | v13,32.4 17.5,32.4 18.4,31.5 19.7,31.5 U3.17
  Bottom 0.254: v13,32.4 12,32.4 11.1,31.5 v9.6,31.5 | J1.3 6.46,47.14 5.7,47.9 3.2,47.9 1.6,46.4 1.6,40.8 3.1,39.2 v3.1,31.4
STEP  (via drill 0.3, 0.3 pad 0.25)
  Top 0.254: U5.16 38.6,49.9 39.1,49.4 39.1,49.3 v39.6,48.8 | U3.2 13.38,36.32 v13.9,35.9 | Q1.G 30.66,44.85 v30.4,44.6 | R18.2 20.65,42.45 21.9,43.7 v22.2,43.7
  Bottom 0.254: v39.6,48.8 40.4,49.7 40.4,50.3 39.9,50.8 38.6,50.8 37.9,51.5 37.9,52.3 37.4,52.8 33.7,52.8 32.5,51.6 31.2,51.6 30.4,50.8 v30.4,44.6 23.1,44.6 v22.2,43.7 20.9,42.4 20.9,40.3 18,37.4 17,37.4 15.4,35.9 v13.9,35.9
TX  (via drill 0.3)
  Top 0.254: IC1.5 18.12,5.28 v18.1,5.3 | RN2.1B 12.58,43.28 v13.1,43.8
  Bottom 0.254: v18.1,5.3 18.1,15.8 16.2,17.7 16.2,18.2 8.8,25.6 8.8,32 9,32.2 10.8,32.2 12.1,33.5 12.1,38.6 11.5,39.2 11.5,40.2 13.1,41.8 v13.1,43.8
UPPER_LED  (via drill 0.3)
  Top 0.254: U3.11 14.41,28.29 v14.4,28 | J4.P5 35.12,6.58 34.6,7.1 v31.4,7.1
  Bottom 0.254: v14.4,28 14.4,26.3 31.4,9.3 v31.4,7.1
VUSB
  Top 0.406: C5.1 9.3,13.26 9.3,9.7 9,9.4 8.55,9.4 P1.1
  Top 0.61: C5.1 C3.1 11.75,13.75 12.3,13.2 13.1,13.2 D1.A
WRIST_PWM  (via drill 0.3)
  Top 0.254: U3.14 16.79,29.01 v16.8,28.8 | v36.4,3.8 36.4,5.53 J4.P4
  Bottom 0.254: v16.8,28.8 16.8,26.6 36.4,7 v36.4,3.8

### Text on the board
tPlace: STEPPER | RESET | ROBOT ARM / CONTROLLER | BY DEVON COPELAND | ICSP
bPlace: DESIGNED BY / DEVON COPELAND